# EAGLE schematic TPA3116AudioAmplifier (EAGLE 9.6.2)
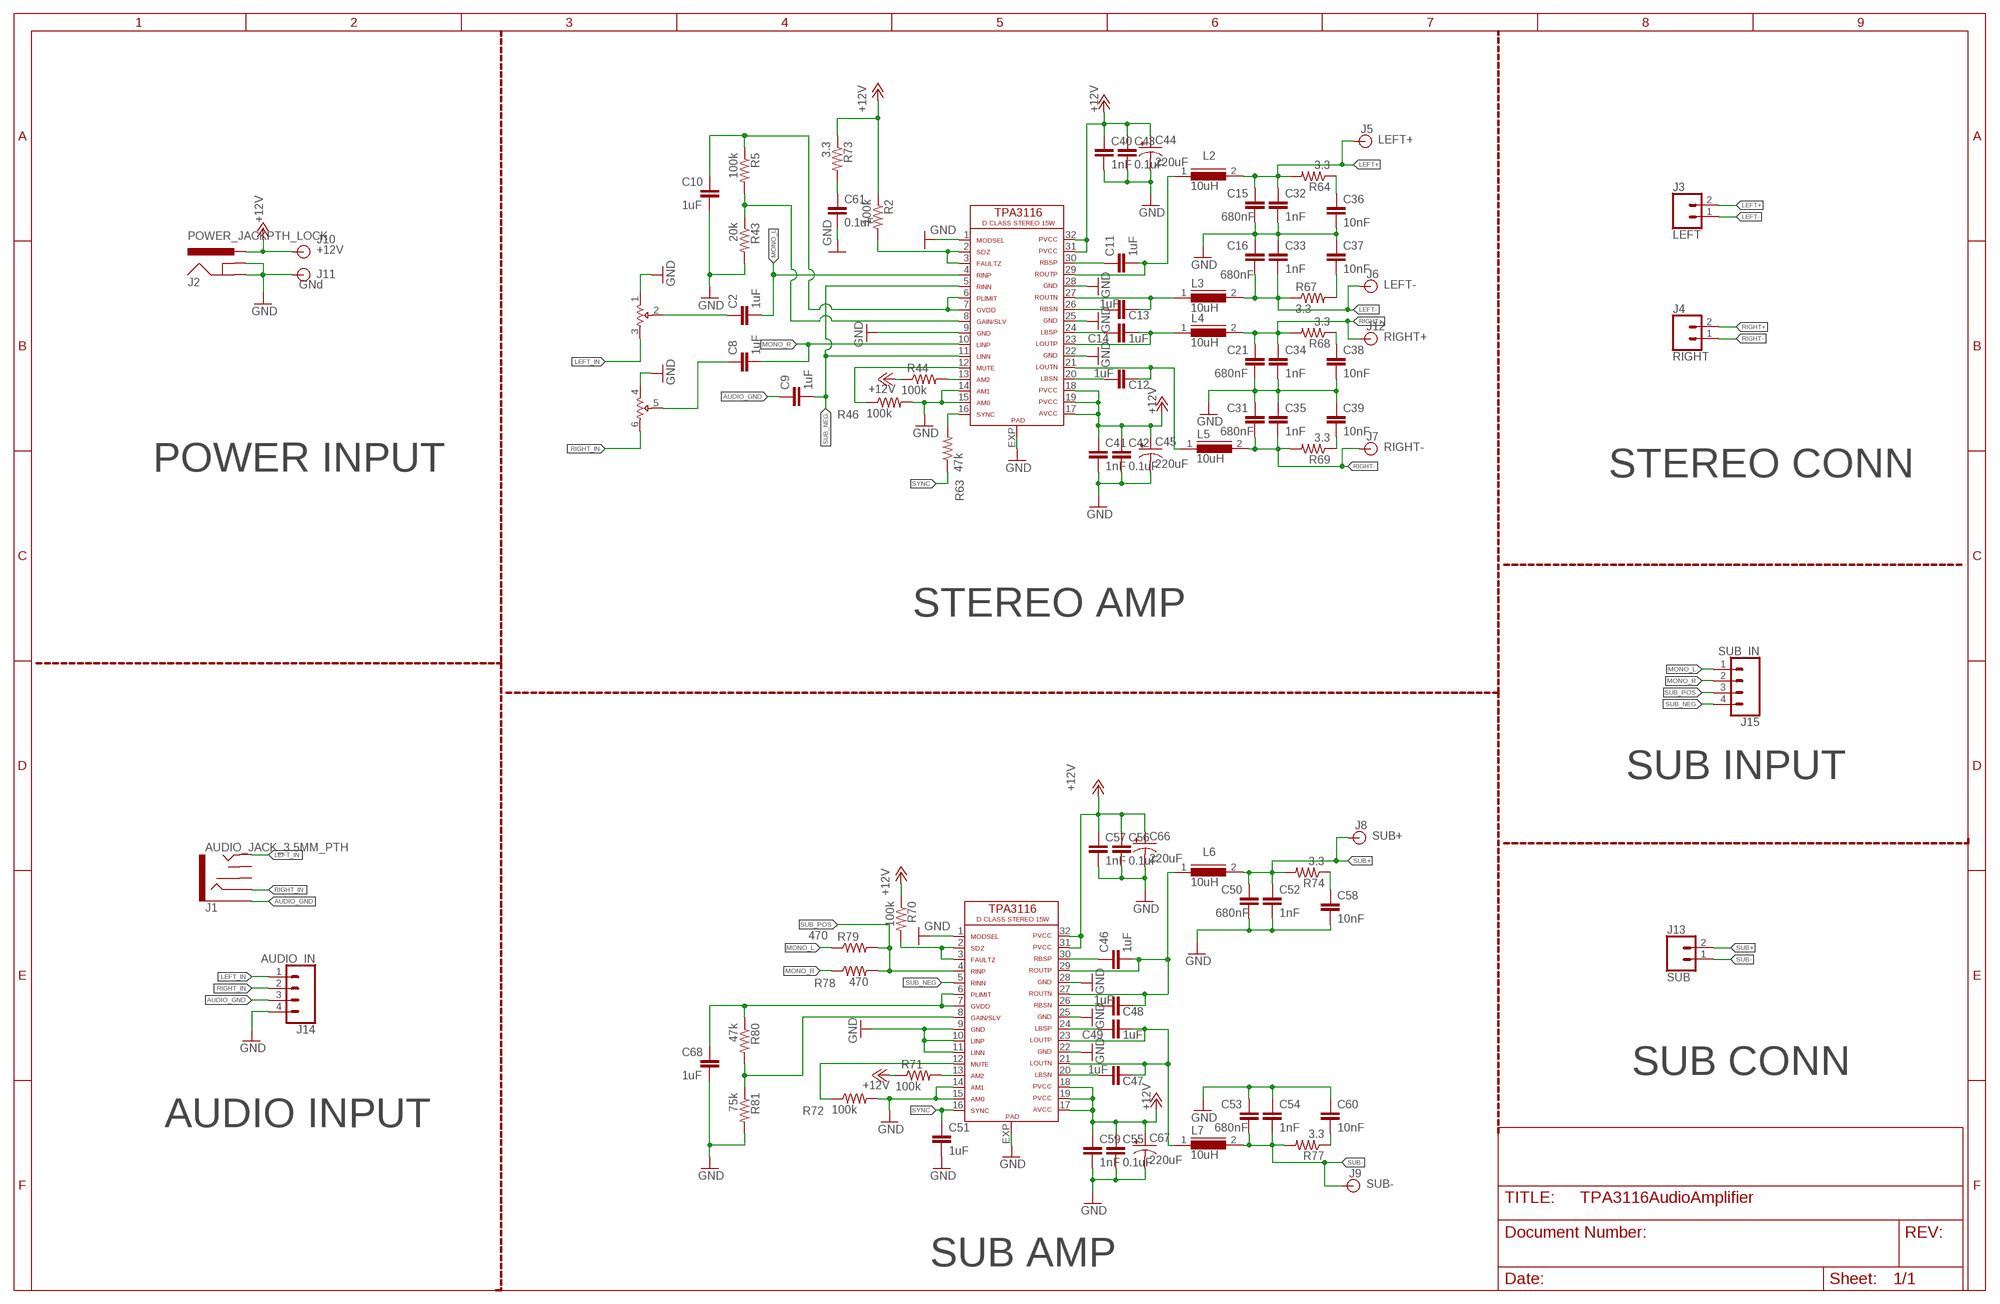
[diagram p0: schematic, sheet 1]

## Parts
C2  1uF  C-EUC0603K  [C0603K]
C8  1uF  C-EUC0603K  [C0603K]
C9  1uF  C-EUC0603K  [C0603K]
C10  1uF  C-EUC0603K  [C0603K]
C11  1uF  C-EUC0603K  [C0603K]
C12  1uF  C-EUC0603K  [C0603K]
C13  1uF  C-EUC0603K  [C0603K]
C14  1uF  C-EUC0603K  [C0603K]
C15  680nF  C-EUC0805  [C0805]
C16  680nF  C-EUC0805  [C0805]
C21  680nF  C-EUC0805  [C0805]
C31  680nF  C-EUC0805  [C0805]
C32  1nF  C-EUC0603K  [C0603K]
C33  1nF  C-EUC0603K  [C0603K]
C34  1nF  C-EUC0603K  [C0603K]
C35  1nF  C-EUC0603K  [C0603K]
C36  10nF  C-EUC0603K  [C0603K]
C37  10nF  C-EUC0603K  [C0603K]
C38  10nF  C-EUC0603K  [C0603K]
C39  10nF  C-EUC0603K  [C0603K]
C40  1nF  C-EUC0603K  [C0603K]
C41  1nF  C-EUC0603K  [C0603K]
C42  0.1uF  C-EUC0603K  [C0603K]
C43  0.1uF  C-EUC0603K  [C0603K]
C44  220uF  CPOL-USE5-10.5  [E5-10,5]
C45  220uF  CPOL-USE5-10.5  [E5-10,5]
C46  1uF  C-EUC0603K  [C0603K]
C47  1uF  C-EUC0603K  [C0603K]
C48  1uF  C-EUC0603K  [C0603K]
C49  1uF  C-EUC0603K  [C0603K]
C50  680nF  C-EUC0805  [C0805]
C51  1uF  C-EUC0603K  [C0603K]
C52  1nF  C-EUC0603K  [C0603K]
C53  680nF  C-EUC0805  [C0805]
C54  1nF  C-EUC0603K  [C0603K]
C55  0.1uF  C-EUC0603K  [C0603K]
C56  0.1uF  C-EUC0603K  [C0603K]
C57  1nF  C-EUC0603K  [C0603K]
C58  10nF  C-EUC0603K  [C0603K]
C59  1nF  C-EUC0603K  [C0603K]
C60  10nF  C-EUC0603K  [C0603K]
C61  0.1uF  C-EUC0603K  [C0603K]
C66  220uF  CPOL-USE5-10.5  [E5-10,5]
C67  220uF  CPOL-USE5-10.5  [E5-10,5]
C68  1uF  C-EUC0603K  [C0603K]
J1  AUDIO_JACK_3.5MM_PTH  [AUDIO-JACK]
J2  POWER_JACKPTH_LOCK  [POWER_JACK_PTH_LOCK]
J3  LEFT  CONN_025MM  [SCREWTERMINAL-5MM-2]
J4  RIGHT  CONN_025MM  [SCREWTERMINAL-5MM-2]
J5  LEFT+  BANANA_CONN  [BANANA_CONN]
J6  LEFT-  BANANA_CONN  [BANANA_CONN]
J7  RIGHT-  BANANA_CONN  [BANANA_CONN]
J8  SUB+  BANANA_CONN  [BANANA_CONN]
J9  SUB-  BANANA_CONN  [BANANA_CONN]
J10  +12V  BANANA_CONN  [BANANA_CONN]
J11  GNd  BANANA_CONN  [BANANA_CONN]
J12  RIGHT+  BANANA_CONN  [BANANA_CONN]
J13  SUB  CONN_025MM  [SCREWTERMINAL-5MM-2]
J14  AUDIO_IN  CONN_04  [1X04]
J15  SUB_IN  CONN_04  [1X04]
L2  10uH  DR125  [DR125]
L3  10uH  DR125  [DR125]
L4  10uH  DR125  [DR125]
L5  10uH  DR125  [DR125]
L6  10uH  DR125  [DR125]
L7  10uH  DR125  [DR125]
R2  100k  R-US_R0805  [R0805]
R5  100k  R-US_R0805  [R0805]
R43  20k  R-US_R0805  [R0805]
R44  100k  R-US_R0805  [R0805]
R46  100k  R-US_R0805  [R0805]
R63  47k  R-US_R0805  [R0805]
R64  3.3  R-US_M0805  [M0805]
R67  3.3  R-US_M0805  [M0805]
R68  3.3  R-US_M0805  [M0805]
R69  3.3  R-US_M0805  [M0805]
R70  100k  R-US_R0805  [R0805]
R71  100k  R-US_R0805  [R0805]
R72  100k  R-US_R0805  [R0805]
R73  3.3  R-US_M0805  [M0805]
R74  3.3  R-US_M0805  [M0805]
R77  3.3  R-US_M0805  [M0805]
R78  470  R-US_R0805  [R0805]
R79  470  R-US_R0805  [R0805]
R80  47k  R-US_R0805  [R0805]
R81  75k  R-US_R0805  [R0805]
U$1  TPA3116HTSSOP32  [HTSSOP32DAP]
U$2  DUAL_POT_H  [DUAL_POT_H]
U$3  TPA3116HTSSOP32  [HTSSOP32DAP]

## Nets
+12V: C40.1 C41.1 C42.1 C43.1 C44.+ C45.+ C55.1 C56.1 C57.1 C59.1 C66.+ C67.+ J2.PWR J10.P$1 R2.1 R44.1 R70.1 R71.1 R73.1 U$1.17(AVCC) U$1.18(PVCC0) U$1.19(PVCC1) U$1.31(PVCC2) U$1.32(PVCC3) U$3.17(AVCC) U$3.18(PVCC0) U$3.19(PVCC1) U$3.31(PVCC2) U$3.32(PVCC3)
AUDIO_GND: C9.1 J1.SLEEVE J14.3
GND: C10.2 C15.2 C16.1 C21.2 C31.1 C32.2 C33.1 C34.2 C35.1 C36.2 C37.1 C38.2 C39.1 C40.2 C41.2 C42.2 C43.2 C44.- C45.- C50.2 C51.2 C52.2 C53.1 C54.1 C55.2 C56.2 C57.2 C58.2 C59.2 C60.1 C61.2 C66.- C67.- C68.2 J2.GND J2.GNDBREAK J11.P$1 J14.4 R43.2 R46.2 R72.2 R81.2 U$1.1(MODSEL) U$1.9(GND0) U$1.10(LINP) U$1.11(LINN) U$1.14(AM1) U$1.15(AM0) U$1.22(GND1) U$1.25(GND2) U$1.28(GND3) U$1.EXP U$2.1 U$2.4 U$3.1(MODSEL) U$3.9(GND0) U$3.14(AM1) U$3.15(AM0) U$3.22(GND1) U$3.25(GND2) U$3.28(GND3) U$3.EXP
LEFT+: C15.1 C32.1 J3.2 J5.P$1 L2.2 R64.2
LEFT-: C16.2 C33.2 J3.1 J6.P$1 L3.2 R67.1
LEFT_IN: J1.TIP J14.1 U$2.3
LOUTN: C13.2 L3.1 U$3.27(ROUTN)
LOUTP: C11.2 L2.1 U$3.29(ROUTP)
MONO_L: C2.2 J15.1 R79.1 U$3.4(RINP)
MONO_R: C8.2 J15.2 R78.1 U$3.10(LINP)
N$2: C8.1 U$2.5
N$4: R70.2 U$1.2(SDZ) U$1.3(FAULTZ)
N$13: C61.1 R73.2
N$14: R2.2 U$3.2(SDZ) U$3.3(FAULTZ)
N$15: R44.2 U$3.13(AM2)
N$17: R46.1 U$3.12(MUTE)
N$18: R5.2 R43.1 U$3.8(GAIN/SLV)
N$20: C2.1 U$2.2
N$21: R80.2 R81.1 U$1.8(GAIN/SLV)
N$22: C10.1 R5.1 U$3.6(PLIMIT) U$3.7(GVDD)
N$60: R63.2 U$3.16(SYNC)
N$64: C11.1 U$3.30(RBSP)
N$66: C12.1 U$3.20(LBSN)
N$70: C13.1 U$3.26(RBSN)
N$71: C14.1 U$3.24(LBSP)
N$73: C68.1 R80.1 U$1.6(PLIMIT) U$1.7(GVDD)
N$75: R71.2 U$1.13(AM2)
N$76: C36.1 R64.1
N$77: R72.1 U$1.12(MUTE)
N$78: C38.1 R68.1
N$80: C37.2 R67.2
N$81: C39.2 R69.1
N$83: C46.1 U$1.30(RBSP)
N$85: C47.1 U$1.20(LBSN)
N$87: C48.1 U$1.26(RBSN)
N$88: C49.1 U$1.24(LBSP)
N$91: C58.1 R74.1
N$94: C60.2 R77.1
RIGHT+: C21.1 C34.1 J4.2 J12.P$1 L4.2 R68.2
RIGHT-: C31.2 C35.2 J4.1 J7.P$1 L5.2 R69.2
RIGHT_IN: J1.RING J14.2 U$2.6
ROUTN: C12.2 L5.1 U$3.21(LOUTN)
ROUTP: C14.2 L4.1 U$3.23(OUTPL)
SOUTN: C47.2 C49.2 L7.1 U$1.21(LOUTN) U$1.23(OUTPL)
SOUTP: C46.2 C48.2 L6.1 U$1.27(ROUTN) U$1.29(ROUTP)
SUB+: C50.1 C52.1 J8.P$1 J13.2 L6.2 R74.2
SUB-: C53.2 C54.2 J9.P$1 J13.1 L7.2 R77.2
SUB_NEG: C9.2 J15.4 U$1.5(RINN) U$3.5(RINN) U$3.11(LINN)
SUB_POS: J15.3 R78.2 R79.2 U$1.4(RINP)
SYNC: C51.1 R63.1 U$1.16(SYNC)
Unconnected: J1.RSH J1.TSH

## Notes on the sheet
- POWER INPUT | STEREO CONN
- STEREO AMP
- SUB INPUT
- SUB CONN
- AUDIO INPUT
- SUB AMP

## Library data of the parts
C2 C8-C16 C21 C31-C43 C46-C61 C68 = rcl:C-EU: CAPACITOR, European symbol; SPICEPREFIX: C
C44 C45 C66 C67 = rcl:CPOL-US: POLARIZED CAPACITOR, American symbol; SPICEPREFIX: C
J1 = SparkFun-Connectors:AUDIO_JACK_3.5MM: Audio Jack 3.5mm variants of PTH and SMT stereo audio jack with bypass switches. SparkFun Products: SparkFun SparkPunk Sound Kit <[https://www.sparkfun.com/products/11177]> - PTH MP3 Trigger <https://www.sparkfun.com/products/13720> -3.5mm SMD SparkFun PicoBoard <https://www.sparkfun.com/products/11888>- 2.5mm SMD; PROD_ID: CONN-08774; SF_ID: PRT-08032
J2 = SparkFun-Connectors:POWER_JACK: Power Jack Connector This is the standard 5.5mm barrel jack for power. The PTH is the most common, proven, reliable, footprint. The Slot footprint only works if the mill layer is transmitted to the PCB fab house so be warned. Here are the connectors we sell at SparkFun: DC Barrel Power Jack/Connector <https://www.sparkfun.com/products/119> (PRT-00119) DC Barrel Power Jack/Connector (SMD) <https://www.sparkfun.com/products/12748> (PRT-12748) DC Barrel Jack Adapter - Breadboard Compatible <https://www.sparkfun.com/products/10811> (PRT-10811) It is used on this SparkFun product (and many, many others): SparkFun RedBoard - Programmed with Arduino <https://www.sparkfun.com/products/12757> (DEV-12757) Also, if you need a mating power supply or connector, please check these out: Wall Adapter Power Supply - 9VDC 650mA <https://www.sparkfun.com/products/298> (TOL-00298) DC Barrel Jack Adapter - Male <https://www.sparkfun.com/products/10287> (PRT-10287); PROD_ID: CONN-08197; SF_ID: PRT-00119
J3 J4 J13 = SparkFun-Connectors:CONN_02: Multi connection point. Often used as Generic Header-pin footprint for 0.1 inch spaced/style header connections On any of the 0.1 inch spaced packages, you can populate with these: Break Away Headers - Straight <https://www.sparkfun.com/products/116> (PRT-00116) Break Away Male Headers - Right Angle <https://www.sparkfun.com/products/553> (PRT-00553) Female Headers <https://www.sparkfun.com/products/115> (PRT-00115) Break Away Headers - Machine Pin <https://www.sparkfun.com/products/117> (PRT-00117) Break Away Female Headers - Swiss Machine Pin <https://www.sparkfun.com/products/743> (PRT-00743) For SCREWTERMINALS and SPRING TERMINALS visit here: Screw Terimnals on SparkFun.com <https://www.sparkfun.com/search/results?term=Screw+Terminals> (5mm/3.5mm/2.54mm spacing) This device is also useful as a general connection point to wire up your design to another part of your project. Our various solder wires solder well into these plated through hole pads. Hook-Up Wire - Assortment (Stranded, 22 AWG) <https://www.sparkfun.com/products/11375> (PRT-11375) Hook-Up Wire - Assortment (Solid Core, 22 AWG) <https://www.sparkfun.com/products/11367> (PRT-11367) View the entire wire category on our website here <https://www.sparkfun.com/categories/141> Special notes: Molex polarized connector foot print use with: PRT-08233 with associated crimp pins and housings. 2.54_SCREWTERM for use with PRT-10571. 3.5mm Screw Terminal footprints for PRT-08084 5mm Screw Terminal footprints for use with PRT-08432; SF_SKU: PRT-08432
J5-J12 = SparkFun-Connectors:BANANA_CONN: Through-hole Banana Jack Basic PTH connection for banana jack plugs SparkFun Products: Multimeter Kit <https://www.sparkfun.com/products/retired/10956> Banana to Alligator Cable <https://www.sparkfun.com/products/retired/509> Banana to Alligator Coax Cable <https://www.sparkfun.com/products/retired/508> Banana to Banana Cable <https://www.sparkfun.com/products/retired/507> Banana to IC Hook Cables <https://www.sparkfun.com/products/retired/506>
J14 J15 = SparkFun-Connectors:CONN_04: Multi connection point. Often used as Generic Header-pin footprint for 0.1 inch spaced/style header connections On any of the 0.1 inch spaced packages, you can populate with these: Break Away Headers - Straight <https://www.sparkfun.com/products/116> (PRT-00116) Break Away Male Headers - Right Angle <https://www.sparkfun.com/products/553> (PRT-00553) Female Headers <https://www.sparkfun.com/products/115> (PRT-00115) Break Away Headers - Machine Pin <https://www.sparkfun.com/products/117> (PRT-00117) Break Away Female Headers - Swiss Machine Pin <https://www.sparkfun.com/products/743> (PRT-00743) For SCREWTERMINALS and SPRING TERMINALS visit here: Screw Terimnals on SparkFun.com <https://www.sparkfun.com/search/results?term=Screw+Terminals> (5mm/3.5mm/2.54mm spacing) This device is also useful as a general connection point to wire up your design to another part of your project. Our various solder wires solder well into these plated through hole pads. Hook-Up Wire - Assortment (Stranded, 22 AWG) <https://www.sparkfun.com/products/11375> (PRT-11375) Hook-Up Wire - Assortment (Solid Core, 22 AWG) <https://www.sparkfun.com/products/11367> (PRT-11367) View the entire wire category on our website here <https://www.sparkfun.com/categories/141> Special notes: Molex polarized connector foot print use with SKU : PRT-08231 with associated crimp pins and housings. 1MM SMD Version SKU: PRT-10208; PROD_ID: CONN-09696
L2-L7 = inductors:DR125: High Power Density, High Efficiency, Shielded Inductors Source: coiltronics_dr_series.pdf; SPICEPREFIX: L
R2 R5 R43 R44 R46 R63 R64 R67-R74 R77-R81 = rcl:R-US_: RESISTOR, American symbol; SPICEPREFIX: R
U$1 U$3 = EzerLonginus:TPA3116
U$2 = EzerLonginus:DUAL_POT_H